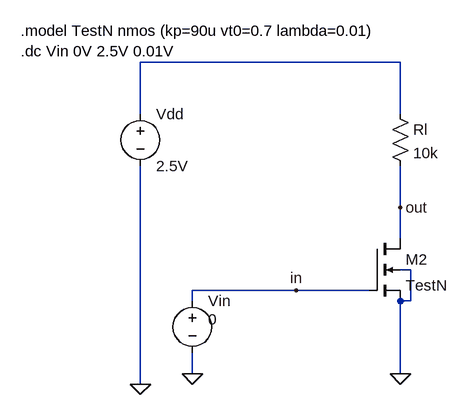
[diagram p0: schematic common-source.asc]
common-source.asc, the LTspice schematic file:
Version 4
SHEET 1 880 1316
WIRE -96 800 -496 800
WIRE -496 880 -496 800
WIRE -96 880 -96 800
WIRE -96 1024 -96 960
WIRE -96 1072 -96 1024
WIRE -80 1120 -96 1120
WIRE -256 1152 -416 1152
WIRE -144 1152 -256 1152
WIRE -416 1168 -416 1152
WIRE -80 1168 -80 1120
WIRE -80 1168 -96 1168
WIRE -416 1280 -416 1248
WIRE -96 1280 -96 1168
WIRE -496 1296 -496 960
FLAG -496 1296 0
FLAG -96 1280 0
FLAG -416 1280 0
FLAG -96 1024 out
FLAG -256 1152 in
SYMBOL voltage -416 1152 R0
WINDOW 3 24 44 Left 2
SYMATTR Value 0
SYMATTR InstName Vin
SYMBOL voltage -496 864 R0
WINDOW 123 0 0 Left 2
WINDOW 39 0 0 Left 2
SYMATTR InstName Vdd
SYMATTR Value 2.5V
SYMBOL nmos4 -144 1072 R0
SYMATTR InstName M2
SYMATTR Value TestN
SYMATTR Value2 l=10u w=100u
SYMBOL res -112 864 R0
SYMATTR InstName Rl
SYMATTR Value 10k
TEXT -680 752 Left 2 !.model TestN nmos (kp=90u vt0=0.7 lambda=0.01)\n.dc Vin 0V 2.5V 0.01V

The netlist it stands for:
* common-source.asc
Vin in 0 0
Vdd N001 0 2.5V
M2 out in 0 0 TestN l=10u w=100u
Rl N001 out 10k
.model NMOS NMOS
.model PMOS PMOS
.lib standard.mos
.model TestN nmos (kp=90u vt0=0.7 lambda=0.01)
.dc Vin 0V 2.5V 0.01V
.backanno
.end